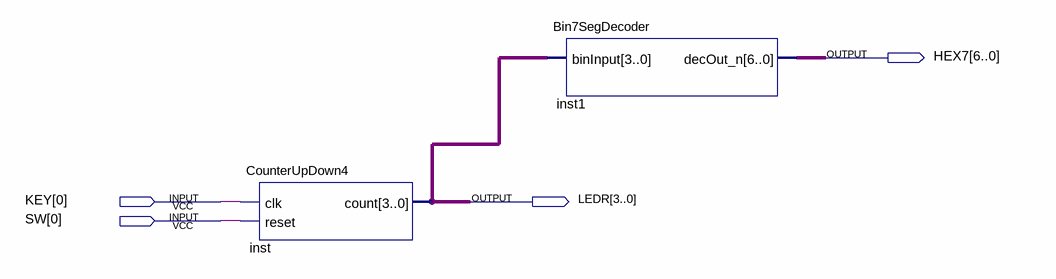
[diagram p0: schematic sheet]
// Quartus schematic Counter_Demo.bdf as structural Verilog: 2 symbols, 4 pins
module Counter_Demo (
  input  [0:0] KEY,
  input  [0:0] SW,
  output [6:0] HEX7,
  output [3:0] LEDR
);

  CounterUpDown4 inst (.clk(KEY[0]), .reset(SW[0]), .count(LEDR));
  Bin7SegDecoder inst1 (.binInput(LEDR), .decOut_n(HEX7));
endmodule
